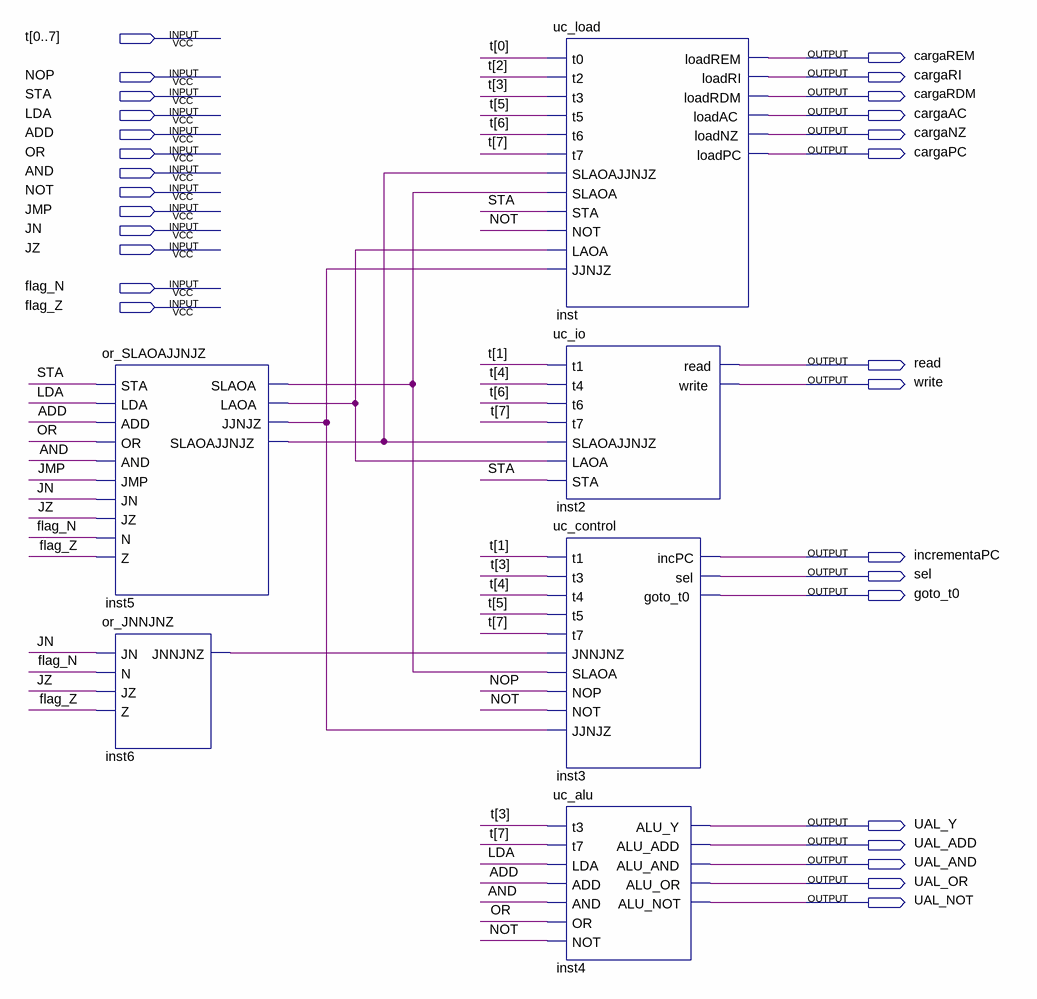
[diagram p0: schematic sheet]
// Quartus schematic teste_uc.bdf as structural Verilog: 6 symbols, 29 pins
module teste_uc (
  input  [0:7] t,
  input  NOP,
  input  STA,
  input  LDA,
  input  ADD,
  input  OR,
  input  AND,
  input  NOT,
  input  JMP,
  input  JN,
  input  JZ,
  input  flag_N,
  input  flag_Z,
  output cargaREM,
  output cargaRI,
  output cargaRDM,
  output cargaAC,
  output cargaNZ,
  output cargaPC,
  output read,
  output write,
  output incrementaPC,
  output sel,
  output goto_t0,
  output UAL_Y,
  output UAL_ADD,
  output UAL_AND,
  output UAL_OR,
  output UAL_NOT
);

  wire inst5_jjnjz, inst5_laoa, inst5_slaoa, inst5_slaoajjnjz, inst6_jnnjnz;

  or_SLAOAJJNJZ inst5 (
    .STA(STA), .LDA(LDA), .ADD(ADD), .OR(OR), .AND(AND), .JMP(JMP), .JN(JN), .JZ(JZ), .N(flag_N), .Z(flag_Z),
    .SLAOA(inst5_slaoa), .LAOA(inst5_laoa), .JJNJZ(inst5_jjnjz), .SLAOAJJNJZ(inst5_slaoajjnjz));
  or_JNNJNZ inst6 (.JN(JN), .N(flag_N), .JZ(JZ), .Z(flag_Z), .JNNJNZ(inst6_jnnjnz));
  uc_load inst (
    .t0(t[0]), .t2(t[2]), .t3(t[3]), .t5(t[5]), .t6(t[6]), .t7(t[7]), .SLAOAJJNJZ(inst5_slaoajjnjz),
    .SLAOA(inst5_slaoa), .STA(STA), .NOT(NOT), .LAOA(inst5_laoa), .JJNJZ(inst5_jjnjz), .loadREM(cargaREM),
    .loadRI(cargaRI), .loadRDM(cargaRDM), .loadAC(cargaAC), .loadNZ(cargaNZ), .loadPC(cargaPC));
  uc_io inst2 (
    .t1(t[1]), .t4(t[4]), .t6(t[6]), .t7(t[7]), .SLAOAJJNJZ(inst5_slaoajjnjz), .LAOA(inst5_laoa), .STA(STA),
    .read(read), .write(write));
  uc_control inst3 (
    .t1(t[1]), .t3(t[3]), .t4(t[4]), .t5(t[5]), .t7(t[7]), .JNNJNZ(inst6_jnnjnz), .SLAOA(inst5_slaoa),
    .NOP(NOP), .NOT(NOT), .JJNJZ(inst5_jjnjz), .incPC(incrementaPC), .sel(sel), .goto_t0(goto_t0));
  uc_alu inst4 (
    .t3(t[3]), .t7(t[7]), .LDA(LDA), .ADD(ADD), .AND(AND), .OR(OR), .NOT(NOT), .ALU_Y(UAL_Y),
    .ALU_ADD(UAL_ADD), .ALU_AND(UAL_AND), .ALU_OR(UAL_OR), .ALU_NOT(UAL_NOT));
endmodule
